# Altium project smart-water-quality-breakout.PrjPcb (part 2 of 5)

## Sheet battery-balancer.SchDoc
size Legal
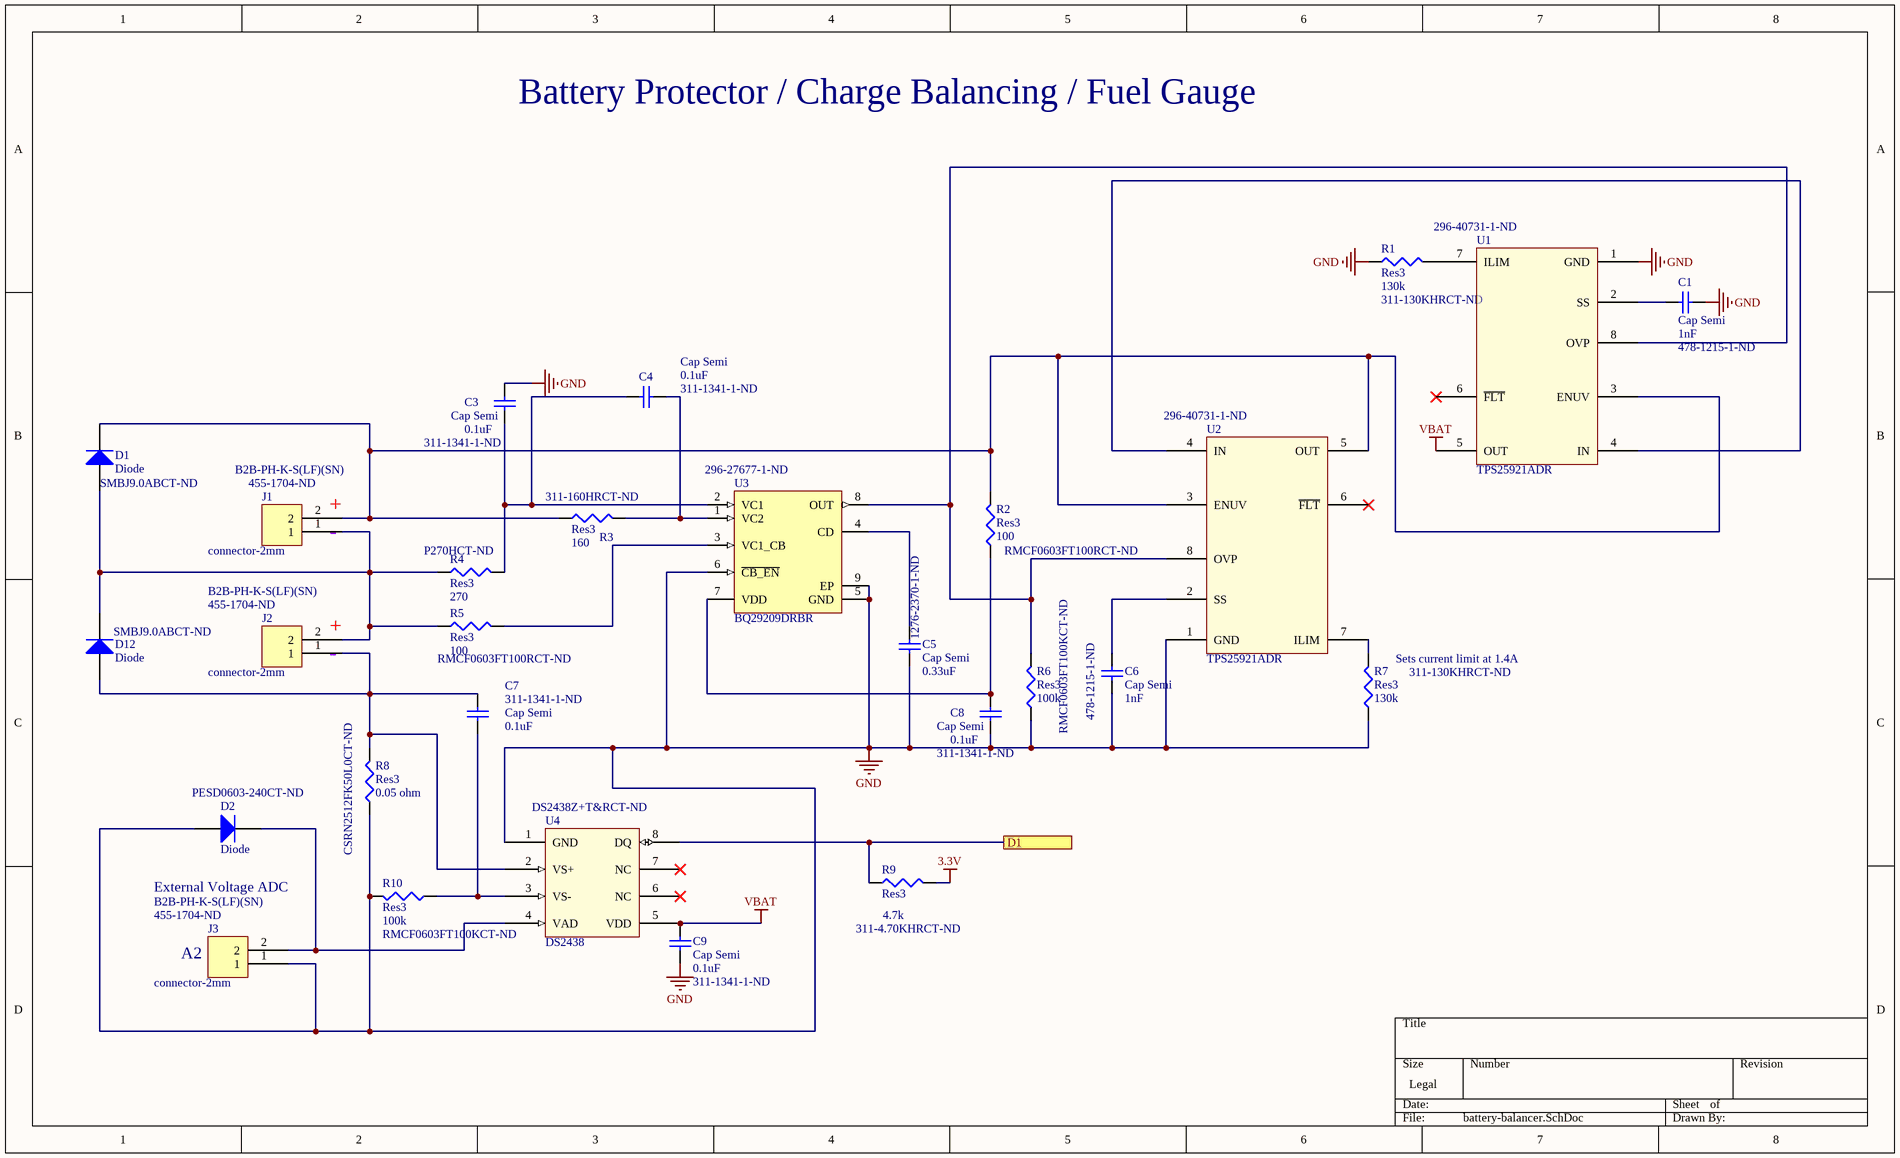
[diagram p1: battery-balancer.SchDoc]

### Parts
C1  Cap Semi  value 1nF  Supplier Part Number 1: 478-1215-1-ND  [1608[0603]]
C3  Cap Semi  value 0.1uF  Supplier Part Number 1: 311-1341-1-ND  [1608[0603]]
C4  Cap Semi  value 0.1uF  Supplier Part Number 1: 311-1341-1-ND  [1608[0603]]
C5  Cap Semi  value 0.33uF  Supplier Part Number 1: 1276-2370-1-ND  [1608[0603]]
C6  Cap Semi  value 1nF  Supplier Part Number 1: 478-1215-1-ND  [1608[0603]]
C7  Cap Semi  value 0.1uF  Supplier Part Number 1: 311-1341-1-ND  [1608[0603]]
C8  Cap Semi  value 0.1uF  Supplier Part Number 1: 311-1341-1-ND  [1608[0603]]
C9  Cap Semi  value 0.1uF  Supplier Part Number 1: 311-1341-1-ND  [1608[0603]]
D1  Diode  Supplier Part Number 1: SMBJ9.0ABCT-ND  [smbj]
D2  Diode  Supplier Part Number 1: PESD0603-240CT-ND  [J1-0603]
D12  Diode  Supplier Part Number 1: SMBJ9.0ABCT-ND  [smbj]
J1  connector-2mm  Supplier Part Number 1: 455-1704-ND  [B2B-PH-K-S(LF)(SN)]
J2  connector-2mm  Supplier Part Number 1: 455-1704-ND  [B2B-PH-K-S(LF)(SN)]
J3  connector-2mm  Supplier Part Number 1: 455-1704-ND  [B2B-PH-K-S(LF)(SN)]
R1  Res3  value 130k  Supplier Part Number 1: 311-130KHRCT-ND  [J1-0603]
R2  Res3  value 100  Supplier Part Number 1: RMCF0603FT100RCT-ND  [J1-0603]
R3  Res3  value 160  Supplier Part Number 1: 311-160HRCT-ND  [J1-0603]
R4  Res3  value 270  Supplier Part Number 1: P270HCT-ND  [J1-0603]
R5  Res3  value 100  Supplier Part Number 1: RMCF0603FT100RCT-ND  [J1-0603]
R6  Res3  value 100k  Supplier Part Number 1: RMCF0603FT100KCT-ND  [J1-0603]
R7  Res3  value 130k  Supplier Part Number 1: 311-130KHRCT-ND  [J1-0603]
R8  Res3  value 0.05 ohm  Supplier Part Number 1: CSRN2512FK50L0CT-ND  [2512-resistor]
R9  Res3  value 4.7k  Supplier Part Number 1: 311-4.70KHRCT-ND  [J1-0603]
R10  Res3  value 100k  Supplier Part Number 1: RMCF0603FT100KCT-ND  [J1-0603]
U1  TPS25921ADR  Supplier Part Number 1: 296-40731-1-ND  [D0008A_L]
U2  TPS25921ADR  Supplier Part Number 1: 296-40731-1-ND  [D0008A_L]
U3  BQ29209DRBR  Supplier Part Number 1: 296-27677-1-ND  [DRB0008B_V]
U4  DS2438  Supplier Part Number 1: DS2438Z+T&RCT-ND  [21-0041B_8]

### Ports
D1

### Nets
3.3V: R9.2
GND: C1.1 C3.2 C5.2 C6.1 C8.1 C9.2 D2.1(A) J3.1 R1.1 R6.1 R7.1 R8.1 R10.2 U1.1(GND) U2.1(GND) U3.5(GND) U3.6(~{CB_EN}) U3.9(EP) U4.1(GND)
VBAT: C9.1 U1.5(OUT) U4.5(VDD)
NetC1_2: C1.2 U1.2(SS)
NetC3_1: C3.1 C4.2 R4.2 U3.2(VC1)
NetC4_1: C4.1 R3.2 U3.1(VC2)
NetC5_1: C5.1 U3.4(CD)
NetC6_2: C6.2 U2.2(SS)
NetC7_1: C7.1 R10.1 U4.3(VS-)
NetC7_2: C7.2 D12.1(A) J2.1 R8.2 U4.2(VS+)
NetC8_2: C8.2 R2.1 U3.7(VDD)
NetD1_1: D1.1(A) D12.2(K) J1.1 J2.2 R4.1 R5.1
NetD1_2: D1.2(K) J1.2 R2.2 R3.1 U1.3(ENUV) U2.3(ENUV) U2.5(OUT)
NetD2_2: D2.2(K) J3.2 U4.4(VAD)
NetR1_2: R1.2 U1.7(ILIM)
NetR5_2: R5.2 U3.3(VC1_CB)
NetR6_2: R6.2 U1.8(OVP) U2.8(OVP) U3.8(OUT)
NetR7_2: R7.2 U2.7(ILIM)
NetR9_1: R9.1 U4.8(DQ) ; port D1
NetU1_4: U1.4(IN) U2.4(IN)

Not connected (* = marked no-connect by the designer): U1 6(~{FLT})*; U2 6(~{FLT})*; U4 6(NC)* 7(NC)*

### Notes on the sheet
- Battery Protector / Charge Balancing / Fuel Gauge
- (near J1) +
- (near J1) -
- (near J2) +
- (near J2) -
- (near R7) Sets current limit at 1.4A
- External Voltage ADC
- (near J3) A2

### Library data of the parts
C1 C6 = Cap Semi: Capacitor (Semiconductor SIM Model); Manufacturer: Kyocera AVX; Manufacturer Part Number: 06035C102KAT2A; Dielectric Material: Ceramic; Tolerance: 10%; Dielectric: X7R; Voltage Rating (DC): 50V; Published: 8-Jun-2000; LatestRevisionDate: 29-May-2009; LatestRevisionNote: IPC-7351 Footprint Added.; PackageReference: C1206; Publisher: Altium Limited; PackageDescription: Chip Capacitor; Supplier 1: Digi-Key; Stock 1: 5706824; Pricing 1: 1 = 0.10000, 10 = 0.05800, 100 = 0.02590, 500 = 0.01852, 1000 = 0.01455 (USD); RoHS: Yes; Mount: Surface Mount; Case/Package: 0603; Number of Pins: 2; Weight: 7.1E-05oz; Case Code (Imperial): 0603; Case Code (Metric): 1608; Contact Plating: Tin; Min Operating Temperature: -55°C; Max Operating Temperature: 125°C; Capacitance: 1nF; Packaging: Tape and Reel; Voltage: 50V; Voltage Rating: 50V; Package Quantity: 4000; Termination: SMD/SMT; Length: 1.6mm; Height: 0.9mm; Depth: 0.81mm; Width: 0.81mm; Thickness: 0.035inch; Radiation Hardening: No; REACH SVHC: No SVHC; Lead Free: Lead Free; ComponentLink1URL: https://datasheet.ciiva.com/11787/0900766b802d4698-11787050.pdf?src-supplier=RSComponents; ComponentLink1Description: https://datasheet.ciiva.com/11787/0900766b802d4698-11787050.pdf?src-supplier=RSComponents; ComponentLink2URL: https://datasheet.ciiva.com/1124/1679506-1124839.pdf?src-supplier=Element14; ComponentLink2Description: https://datasheet.ciiva.com/1124/1679506-1124839.pdf?src-supplier=Element14; ComponentLink3URL: https://datasheet.ciiva.com/14595/70001075-14595287.pdf?src-supplier=Allied+Electronics; ComponentLink3Description: https://datasheet.ciiva.com/14595/70001075-14595287.pdf?src-supplier=Allied+Electronics; ComponentLink4URL: https://datasheet.ciiva.com/1124/1679506-1124840.pdf?src-supplier=Element14; ComponentLink4Description: https://datasheet.ciiva.com/1124/1679506-1124840.pdf?src-supplier=Element14; ComponentLink5URL: https://datasheet.ciiva.com/7855/1679506-7855080.pdf?src-supplier=Element14; ComponentLink5Description: https://datasheet.ciiva.com/7855/1679506-7855080.pdf?src-supplier=Element14; ComponentLink6URL: https://datasheet.ciiva.com/2987/cx7r-2987819.pdf?src-supplier=Avnet; ComponentLink6Description: https://datasheet.ciiva.com/2987/cx7r-2987819.pdf?src-supplier=Avnet; ComponentLink7URL: https://datasheet.ciiva.com/150/cx7r-150236.pdf?src-supplier=Digi-Key; ComponentLink7Description: https://datasheet.ciiva.com/150/cx7r-150236.pdf?src-supplier=Digi-Key; ComponentLink8URL: https://datasheet.ciiva.com/2987/cx7r-2987820.pdf?src-supplier=Avnet; ComponentLink8Description: https://datasheet.ciiva.com/2987/cx7r-2987820.pdf?src-supplier=Avnet; ComponentLink9URL: https://datasheet.ciiva.com/150/cx7r-150237.pdf?src-supplier=Digi-Key; ComponentLink9Description: https://datasheet.ciiva.com/150/cx7r-150237.pdf?src-supplier=Digi-Key; ComponentLink10URL: https://datasheet.ciiva.com/16327/cx7r-16327069.pdf?src-supplier=Future+Electronics; ComponentLink10Description: https://datasheet.ciiva.com/16327/cx7r-16327069.pdf?src-supplier=Future+Electronics; ComponentLink11URL: https://datasheet.ciiva.com/16538/cx7r-16538173.pdf?src-supplier=Avnet+Asia; ComponentLink11Description: https://datasheet.ciiva.com/16538/cx7r-16538173.pdf?src-supplier=Avnet+Asia; ComponentLink12URL: https://datasheet.ciiva.com/150/cx7r-150238.pdf?src-supplier=Digi-Key; ComponentLink12Description: https://datasheet.ciiva.com/150/cx7r-150238.pdf?src-supplier=Digi-Key
C3 C4 C7-C9 = Cap Semi: Capacitor (Semiconductor SIM Model); Manufacturer: Yageo; Manufacturer Part Number: CC0603KRX7R8BB104; Capacitance: 100nF; Tolerance: 10%; Dielectric: X7R; Voltage Rating: 25V; Published: 8-Jun-2000; LatestRevisionDate: 29-May-2009; LatestRevisionNote: IPC-7351 Footprint Added.; PackageReference: C1206; Publisher: Altium Limited; PackageDescription: Chip Capacitor; Supplier 1: Digi-Key; Stock 1: 23299362; Pricing 1: 1 = 0.12000, 10 = 0.08400, 100 = 0.03950, 500 = 0.02770, 1000 = 0.02293 (USD); RoHS: Yes; Mount: Surface Mount; Case/Package: 0603; Number of Pins: 2; Case Code (Imperial): 0603; Case Code (Metric): 1608; Min Operating Temperature: -55°C; Max Operating Temperature: 125°C; Packaging: Tape and Reel; Package Quantity: 1; Voltage Rating (DC): 25V; Termination: SMD/SMT; Composition: Ceramic; Voltage: 25V; Length: 1.6mm; Height: 0.8mm; Width: 0.8mm; Thickness: 0.035inch; Depth: 0.8mm; Radiation Hardening: No; REACH SVHC: Unknown; Lead Free: Lead Free; Halogen Free: Halogen Free; ComponentLink1URL: https://datasheet.ciiva.com/11786/0900766b80c10176-11786120.pdf?src-supplier=RSComponents; ComponentLink1Description: https://datasheet.ciiva.com/11786/0900766b80c10176-11786120.pdf?src-supplier=RSComponents; ComponentLink2URL: https://datasheet.ciiva.com/144/mlccorderingcode-144075.pdf?src-supplier=Digi-Key; ComponentLink2Description: https://datasheet.ciiva.com/144/mlccorderingcode-144075.pdf?src-supplier=Digi-Key; ComponentLink3URL: https://datasheet.ciiva.com/17434/upy-gphc-x7r-6-3v-to-50v-8-17434263.pdf?src-supplier=Avnet+Europe; ComponentLink3Description: https://datasheet.ciiva.com/17434/upy-gphc-x7r-6-3v-to-50v-8-17434263.pdf?src-supplier=Avnet+Europe; ComponentLink4URL: https://datasheet.ciiva.com/13389/upy-gphc-x7r-6-3v-to-50v-8-13389352.pdf?src-supplier=Mouser; ComponentLink4Description: https://datasheet.ciiva.com/13389/upy-gphc-x7r-6-3v-to-50v-8-13389352.pdf?src-supplier=Mouser; ComponentLink5URL: https://datasheet.ciiva.com/144/mlccorderingcode-144073.pdf?src-supplier=Digi-Key; ComponentLink5Description: https://datasheet.ciiva.com/144/mlccorderingcode-144073.pdf?src-supplier=Digi-Key; ComponentLink6URL: https://datasheet.ciiva.com/144/mlccorderingcode-144074.pdf?src-supplier=Digi-Key; ComponentLink6Description: https://datasheet.ciiva.com/144/mlccorderingcode-144074.pdf?src-supplier=Digi-Key; ComponentLink7URL: https://datasheet.ciiva.com/26829/getdatasheetpartid-403577-26829431.pdf?src-supplier=Verical; ComponentLink7Description: https://datasheet.ciiva.com/26829/getdatasheetpartid-403577-26829431.pdf?src-supplier=Verical; ComponentLink8URL: https://datasheet.ciiva.com/11587/upy-gphc-x7r-6-3v-to-50v-8-11587208.pdf?src-supplier=Avnet; ComponentLink8Description: https://datasheet.ciiva.com/11587/upy-gphc-x7r-6-3v-to-50v-8-11587208.pdf?src-supplier=Avnet; ComponentLink9URL: https://datasheet.ciiva.com/28450/1489800-28450584.pdf?src-supplier=Element14; ComponentLink9Description: https://datasheet.ciiva.com/28450/1489800-28450584.pdf?src-supplier=Element14; ComponentLink10URL: https://datasheet.ciiva.com/7978/1489800-7978155.pdf?src-supplier=Element14; ComponentLink10Description: https://datasheet.ciiva.com/7978/1489800-7978155.pdf?src-supplier=Element14
C5 = Cap Semi: Capacitor (Semiconductor SIM Model); Manufacturer: Samsung; Manufacturer Part Number: CL10F334ZA8NNNC; Tolerance: 80%; Capacitance: 330nF; Dielectric: Y5V; Voltage Rating: 25V; Published: 8-Jun-2000; LatestRevisionDate: 29-May-2009; LatestRevisionNote: IPC-7351 Footprint Added.; PackageReference: C1206; Publisher: Altium Limited; PackageDescription: Chip Capacitor; Supplier 1: Digi-Key; Stock 1: 209630; Pricing 1: 1 = 0.10000, 10 = 0.06700, 100 = 0.02970, 500 = 0.02122, 1000 = 0.01667 (USD); RoHS: Yes; Mount: Surface Mount; Case/Package: 0603; Case Code (Metric): 1608; Case Code (Imperial): 0603; Contact Plating: Tin; Min Operating Temperature: -30°C; Max Operating Temperature: 85°C; Packaging: Tape and Reel; Package Quantity: 1; Voltage Rating (DC): 25V; Voltage: 25V; Length: 1.6mm; Height: 0.8mm; Width: 0.031inch; Thickness: 0.035inch; Depth: 0.8mm; Radiation Hardening: No; Lead Free: Lead Free; ComponentLink1URL: https://datasheet.ciiva.com/26878/getdatasheetpartid-642180-26878039.pdf?src-supplier=Verical; ComponentLink1Description: https://datasheet.ciiva.com/26878/getdatasheetpartid-642180-26878039.pdf?src-supplier=Verical; ComponentLink2URL: https://datasheet.ciiva.com/16376/cl05b104kq5nnnc-16376699.pdf?src-supplier=Future+Electronics; ComponentLink2Description: https://datasheet.ciiva.com/16376/cl05b104kq5nnnc-16376699.pdf?src-supplier=Future+Electronics
D1 D12 = Diode: Default Diode; Manufacturer: Bourns; Manufacturer Part Number: SMBJ9.0A; Direction: Unidirectional; Reverse Breakdown Voltage: 100V; Operating Supply Voltage: 3.5V; Max Surge Current: 100A; Number of Unidirectional Channels: 1; Reverse Standoff Voltage: 90V; Clamping Voltage: 146V; Peak Pulse Power: 600W; Power Line Protection: No; Max Reverse Leakage Current: 10uA; Test Current: 1mA; Peak Pulse Current: 4.1A; Element Configuration: Single; Leakage Current: 5uA; ComponentLink1URL: http://www.bourns.com/data/global/pdfs/SMBJ.pdf; ComponentLink1Description: http://www.bourns.com/data/global/pdfs/SMBJ.pdf; ComponentLink2URL: https://datasheet.ciiva.com/25624/0900766b810f4eeb-25624683.pdf?src-supplier=RSComponents; ComponentLink2Description: https://datasheet.ciiva.com/25624/0900766b810f4eeb-25624683.pdf?src-supplier=RSComponents; ComponentLink3URL: https://datasheet.ciiva.com/15143/getdatasheetpartid-158332-15143823.pdf?src-supplier=Verical; ComponentLink3Description: https://datasheet.ciiva.com/15143/getdatasheetpartid-158332-15143823.pdf?src-supplier=Verical; ComponentLink4URL: https://datasheet.ciiva.com/331/littelfuse-tvs-diode-smbj-datasheet-pdf-331232.pdf?src-supplier=Digi-Key; ComponentLink4Description: https://datasheet.ciiva.com/331/littelfuse-tvs-diode-smbj-datasheet-pdf-331232.pdf?src-supplier=Digi-Key; ComponentLink5URL: https://datasheet.ciiva.com/8062/littelfuse-tvs-diode-smbj-8062311.pdf?src-supplier=Element14; ComponentLink5Description: https://datasheet.ciiva.com/8062/littelfuse-tvs-diode-smbj-8062311.pdf?src-supplier=Element14; ComponentLink6URL: https://datasheet.ciiva.com/331/littelfuse-tvs-diode-smbj-datasheet-pdf-331230.pdf?src-supplier=Digi-Key; ComponentLink6Description: https://datasheet.ciiva.com/331/littelfuse-tvs-diode-smbj-datasheet-pdf-331230.pdf?src-supplier=Digi-Key; ComponentLink7URL: https://datasheet.ciiva.com/331/littelfuse-tvs-diode-smbj-datasheet-pdf-331231.pdf?src-supplier=Digi-Key; ComponentLink7Description: https://datasheet.ciiva.com/331/littelfuse-tvs-diode-smbj-datasheet-pdf-331231.pdf?src-supplier=Digi-Key; ComponentLink8URL: https://datasheet.ciiva.com/16354/littelfuse-tvs-diode-smbj-16354943.pdf?src-supplier=Future+Electronics; ComponentLink8Description: https://datasheet.ciiva.com/16354/littelfuse-tvs-diode-smbj-16354943.pdf?src-supplier=Future+Electronics; Supplier 1: Digi-Key; Stock 1: 26139; Pricing 1: 1 = 0.48000, 10 = 0.33800, 25 = 0.27800, 100 = 0.22230, 250 = 0.16168, 500 = 0.13136, 1000 = 0.10104 (USD); RoHS: Yes; Mount: Surface Mount; Case/Package: SMB; Number of Pins: 2; Min Operating Temperature: -55°C; Max Operating Temperature: 150°C; Packaging: Tape and Reel; Package Quantity: 3000; Min Breakdown Voltage: 100V; Breakdown Voltage: 100V; Number of Channels: 1; Polarity: Unidirectional; Termination: SMD/SMT; Number of Elements: 1; Max Power Dissipation: 600W; Composition: Zener; Radiation Hardening: No; ComponentLink9URL: https://datasheet.ciiva.com/26787/smbj90a-26787787.pdf?src-supplier=IIIC; ComponentLink9Description: https://datasheet.ciiva.com/26787/smbj90a-26787787.pdf?src-supplier=IIIC; ComponentLink10URL: https://datasheet.ciiva.com/17413/smbj-17413495.pdf?src-supplier=Avnet+Europe; ComponentLink10Description: https://datasheet.ciiva.com/17413/smbj-17413495.pdf?src-supplier=Avnet+Europe; ComponentLink11URL: https://datasheet.ciiva.com/334/smbj-334092.pdf?src-supplier=Digi-Key; ComponentLink11Description: https://datasheet.ciiva.com/334/smbj-334092.pdf?src-supplier=Digi-Key; ComponentLink12URL: https://datasheet.ciiva.com/334/smbj-334188.pdf?src-supplier=Digi-Key; ComponentLink12Description: https://datasheet.ciiva.com/334/smbj-334188.pdf?src-supplier=Digi-Key; ComponentLink13URL: https://datasheet.ciiva.com/334/smbj-334093.pdf?src-supplier=Digi-Key; ComponentLink13Description: https://datasheet.ciiva.com/334/smbj-334093.pdf?src-supplier=Digi-Key; ComponentLink14URL: https://datasheet.ciiva.com/334/smbj-334189.pdf?src-supplier=Digi-Key; ComponentLink14Description: https://datasheet.ciiva.com/334/smbj-334189.pdf?src-supplier=Digi-Key; ComponentLink15URL: https://datasheet.ciiva.com/334/smbj-334094.pdf?src-supplier=Digi-Key; ComponentLink15Description: https://datasheet.ciiva.com/334/smbj-334094.pdf?src-supplier=Digi-Key; ComponentLink16URL: https://datasheet.ciiva.com/334/smbj-334190.pdf?src-supplier=Digi-Key; ComponentLink16Description: https://datasheet.ciiva.com/334/smbj-334190.pdf?src-supplier=Digi-Key
D2 = Diode: Default Diode; Manufacturer: Littelfuse; Manufacturer Part Number: RF1256-000; Clamping Voltage: 45V; Reverse Standoff Voltage: 24V; Power Line Protection: No; Number of Bidirectional Channels: 1; Published: 8-Jun-2000; LatestRevisionDate: 17-Jul-2002; LatestRevisionNote: Re-released for DXP Platform.; PackageVersion: Sep-1996; PackageReference: SMC; Publisher: Altium Limited; PackageDescription: DO-214-AB/SMC; 2 C-Bend Leads; Body 7.9 x 5.9 mm, inc. leads (LxW); Code_JEDEC: DO-214-AB; Supplier 1: Digi-Key; Stock 1: 74186; Pricing 1: 1 = 0.58000, 10 = 0.45300, 25 = 0.38200, 100 = 0.31080, 250 = 0.25752, 500 = 0.21312, 1000 = 0.15984, 2500 = 0.14652 (USD); RoHS: Yes; Mount: Surface Mount; Case/Package: 0603; Case Code (Metric): 1608; Case Code (Imperial): 0603; Min Operating Temperature: -55°C; Max Operating Temperature: 125°C; Packaging: Tape and Reel; Composition: Zener; ComponentLink1URL: http://www.littelfuse.com/~/media/electronics/datasheets/polymer_esd_suppressors/littelfuse_polymer_esd_suppressor_pesd_catalog_datasheet.pdf.pdf?src-supplier=Digi-Key; ComponentLink1Description: http://www.littelfuse.com/~/media/electronics/datasheets/polymer_esd_suppressors/littelfuse_polymer_esd_suppressor_pesd_catalog_datasheet.pdf.pdf?src-supplier=Digi-Key
J1-J3 = connector-2mm: Manufacturer: JST; Connector Type: Male Pin; Current Rating: 2A; Contact Resistance: 20mR; Number of Poles: 2; Voltage Rating: 100V; Insulation Resistance: 1MR; Gender: Male; Pitch: 2mm; Supplier 1: Digi-Key; Manufacturer Part Number: B2B-PH-K-S(LF)(SN); Stock 1: 287924; Pricing 1: 1 = 0.17000, 10 = 0.16200, 100 = 0.10020, 500 = 0.08288, 1000 = 0.07252, 5000 = 0.06216, 10000 = 0.06044 (USD); RoHS: Yes; Mount: Through Hole; Number of Pins: 2; Contact Material: Brass; Contact Plating: Tin; Color: Natural; Housing Color: White; Housing Material: Polyamide; Min Operating Temperature: -25°C; Max Operating Temperature: 85°C; Termination: Solder; Max Current Rating: 2A; Number of Rows: 1; Voltage Rating (AC): 100V; Packaging: Bulk; Number of Positions: 2; Fastening Type: Detent; Max Voltage Rating (AC): 100V; Number of Contacts: 2; Working Voltage: 100V; Max Voltage Rating (DC): 100V; Orientation: Straight; Length: 5.9mm; Height: 9.4mm; Width: 4.5mm; Lead Pitch: 2mm; Contact Mating Length: 0.13inch; Depth: 4.5mm; REACH SVHC: No SVHC; Lead Free: Lead Free; ComponentLink1URL: https://datasheet.ciiva.com/6747/80560-6747392.pdf?src-supplier=Newark; ComponentLink1Description: https://datasheet.ciiva.com/6747/80560-6747392.pdf?src-supplier=Newark; ComponentLink2URL: https://datasheet.ciiva.com/11746/0900766b8082f551-11746676.pdf?src-supplier=RSComponents; ComponentLink2Description: https://datasheet.ciiva.com/11746/0900766b8082f551-11746676.pdf?src-supplier=RSComponents; ComponentLink3URL: https://datasheet.ciiva.com/8052/80560-8052022.pdf?src-supplier=Element14; ComponentLink3Description: https://datasheet.ciiva.com/8052/80560-8052022.pdf?src-supplier=Element14; ComponentLink4URL: https://datasheet.ciiva.com/712/eph-712442.pdf?src-supplier=Digi-Key; ComponentLink4Description: https://datasheet.ciiva.com/712/eph-712442.pdf?src-supplier=Digi-Key; ComponentLink5URL: https://datasheet.ciiva.com/16422/b2b-ph-k-slfsn-16422715.pdf?src-supplier=Future+Electronics; ComponentLink5Description: https://datasheet.ciiva.com/16422/b2b-ph-k-slfsn-16422715.pdf?src-supplier=Future+Electronics
R1 R7 = Res3: Resistor; Manufacturer: Yageo; Manufacturer Part Number: RC0603FR-07130KL; Resistance: 130kR; Tolerance: 1%; Temperature Coefficient: 100ppm/°C; Voltage Rating (DC): 50V; Power Rating: 100mW; Voltage Rating: 75V; Published: 8-Jun-2000; LatestRevisionDate: 29-May-2009; LatestRevisionNote: IPC-7351 Footprint Added.; PackageReference: J1-0603; Publisher: Altium Limited; PackageDescription: Chip Resistor; Supplier 1: Digi-Key; Stock 1: 773087; Pricing 1: 1 = 0.10000, 10 = 0.02400, 100 = 0.00970, 1000 = 0.00437, 2500 = 0.00379 (USD); RoHS: Yes; Case/Package: 0603; Weight: 7.1E-05oz; Case Code (Imperial): 0603; Case Code (Metric): 1608; Min Operating Temperature: -55°C; Max Operating Temperature: 155°C; Packaging: Tape and Reel; Composition: Thick Film; Package Quantity: 1; Termination: SMD/SMT; Number of Terminations: 2; Military Standard: Not; Max Power Dissipation: 100mW; Features: Moisture Resistant; Length: 1.6mm; Height: 0.022inch; Width: 0.8mm; Depth: 0.8mm; Lead Free: Lead Free; ComponentLink1URL: https://datasheet.ciiva.com/2455/pyu-r-int-thick-7-2455192.pdf?src-supplier=Digi-Key; ComponentLink1Description: https://datasheet.ciiva.com/2455/pyu-r-int-thick-7-2455192.pdf?src-supplier=Digi-Key; ComponentLink2URL: https://datasheet.ciiva.com/2455/pyu-r-int-thick-7-2455191.pdf?src-supplier=Digi-Key; ComponentLink2Description: https://datasheet.ciiva.com/2455/pyu-r-int-thick-7-2455191.pdf?src-supplier=Digi-Key; ComponentLink3URL: https://datasheet.ciiva.com/2455/pyu-r-int-thick-7-2455193.pdf?src-supplier=Digi-Key; ComponentLink3Description: https://datasheet.ciiva.com/2455/pyu-r-int-thick-7-2455193.pdf?src-supplier=Digi-Key
R2 R5 = Res3: Resistor; Manufacturer: Stackpole Electronics; Manufacturer Part Number: RMCF0603FT100R; Resistance: 100R; Power Rating: 100mW; Tolerance: 1%; Temperature Coefficient: 100ppm/°C; Published: 8-Jun-2000; LatestRevisionDate: 29-May-2009; LatestRevisionNote: IPC-7351 Footprint Added.; PackageReference: J1-0603; Publisher: Altium Limited; PackageDescription: Chip Resistor; Supplier 1: Digi-Key; Stock 1: 2775736; Pricing 1: 1 = 0.10000, 10 = 0.01700, 100 = 0.00680, 1000 = 0.00306, 2500 = 0.00266 (USD); RoHS: Yes; Mount: Surface Mount; Case/Package: 0603; Case Code (Metric): 1608; Case Code (Imperial): 0603; Contact Plating: Tin; Min Operating Temperature: -55°C; Max Operating Temperature: 155°C; Packaging: Tape and Reel; Composition: Thick Film; Number of Terminations: 2; Military Standard: Not; Max Power Dissipation: 100mW; Features: Automotive AEC-Q200; Length: 1.55mm; Height: 0.022inch; Width: 0.031inch; Depth: 0.8mm; Radiation Hardening: No; Lead Free: Lead Free; ComponentLink1URL: https://datasheet.ciiva.com/15215/getdatasheetpartid-360413-15215981.pdf?src-supplier=Verical; ComponentLink1Description: https://datasheet.ciiva.com/15215/getdatasheetpartid-360413-15215981.pdf?src-supplier=Verical
R3 = Res3: Resistor; Manufacturer: Yageo; Manufacturer Part Number: RC0603FR-07160RL; Tolerance: 1%; Power Rating: 100mW; Resistance: 160R; Voltage Rating: 75V; Temperature Coefficient: 100ppm/°C; Voltage Rating (DC): 50V; Published: 8-Jun-2000; LatestRevisionDate: 29-May-2009; LatestRevisionNote: IPC-7351 Footprint Added.; PackageReference: J1-0603; Publisher: Altium Limited; PackageDescription: Chip Resistor; Supplier 1: Digi-Key; Stock 1: 508932; Pricing 1: 1 = 0.10000, 10 = 0.02400, 100 = 0.00970, 1000 = 0.00437, 2500 = 0.00379 (USD); RoHS: Yes; Mount: Surface Mount; Case/Package: 0603; Weight: 7.1E-05oz; Case Code (Metric): 1608; Case Code (Imperial): 0603; Min Operating Temperature: -55°C; Max Operating Temperature: 155°C; Packaging: Tape and Reel; Package Quantity: 1; Composition: Thick Film; Number of Terminations: 2; Termination: SMD/SMT; Military Standard: Not; Max Power Dissipation: 100mW; Features: Moisture Resistant; Length: 1.6mm; Height: 0.45mm; Width: 0.031inch; Depth: 0.8mm; Lead Free: Lead Free; ComponentLink1URL: https://datasheet.ciiva.com/11808/0900766b80f96399-11808753.pdf?src-supplier=RSComponents; ComponentLink1Description: https://datasheet.ciiva.com/11808/0900766b80f96399-11808753.pdf?src-supplier=RSComponents; ComponentLink2URL: https://datasheet.ciiva.com/2454/pyu-r-int-thick-7-2454168.pdf?src-supplier=Digi-Key; ComponentLink2Description: https://datasheet.ciiva.com/2454/pyu-r-int-thick-7-2454168.pdf?src-supplier=Digi-Key; ComponentLink3URL: https://datasheet.ciiva.com/2454/pyu-r-int-thick-7-2454169.pdf?src-supplier=Digi-Key; ComponentLink3Description: https://datasheet.ciiva.com/2454/pyu-r-int-thick-7-2454169.pdf?src-supplier=Digi-Key; ComponentLink4URL: https://datasheet.ciiva.com/2454/pyu-r-int-thick-7-2454170.pdf?src-supplier=Digi-Key; ComponentLink4Description: https://datasheet.ciiva.com/2454/pyu-r-int-thick-7-2454170.pdf?src-supplier=Digi-Key
R4 = Res3: Resistor; Manufacturer: Panasonic; Manufacturer Part Number: ERJ3EKF2700V; Resistance: 270R; Tolerance: 1%; Temperature Coefficient: 100ppm/°C; Power Rating: 100mW; Voltage Rating: 75V; Published: 8-Jun-2000; LatestRevisionDate: 29-May-2009; LatestRevisionNote: IPC-7351 Footprint Added.; PackageReference: J1-0603; Publisher: Altium Limited; PackageDescription: Chip Resistor; Supplier 1: Digi-Key; Stock 1: 596359; Pricing 1: 1 = 0.10000, 10 = 0.06500, 100 = 0.02640, 1000 = 0.01186, 2500 = 0.01029 (USD); RoHS: Yes; Mount: Surface Mount; Case/Package: 0603; Number of Pins: 2; Contact Plating: Tin; Case Code (Imperial): 0603; Case Code (Metric): 1608; Min Operating Temperature: -55°C; Max Operating Temperature: 155°C; Composition: Thick Film; Packaging: Tape and Reel; Package Quantity: 1; Number of Terminations: 2; Military Standard: Not; Termination: SMD/SMT; Max Power Dissipation: 100mW; Voltage Rating (DC): 75V; Features: Automotive AEC-Q200; Length: 1.6mm; Height: 0.022inch; Width: 0.8mm; Depth: 0.8mm; Radiation Hardening: No; REACH SVHC: No SVHC; Lead Free: Lead Free; ComponentLink1URL: https://datasheet.ciiva.com/5860/aoa0000ce2-5860661.pdf?src-supplier=Farnell; ComponentLink1Description: https://datasheet.ciiva.com/5860/aoa0000ce2-5860661.pdf?src-supplier=Farnell; ComponentLink2URL: https://datasheet.ciiva.com/9183/aoa0000ce2-9183606.pdf?src-supplier=Avnet; ComponentLink2Description: https://datasheet.ciiva.com/9183/aoa0000ce2-9183606.pdf?src-supplier=Avnet; ComponentLink3URL: https://datasheet.ciiva.com/16776/70260748-16776089.pdf?src-supplier=Allied+Electronics; ComponentLink3Description: https://datasheet.ciiva.com/16776/70260748-16776089.pdf?src-supplier=Allied+Electronics; ComponentLink4URL: https://datasheet.ciiva.com/17206/aoa0000ce2-17206490.pdf?src-supplier=Avnet+Europe; ComponentLink4Description: https://datasheet.ciiva.com/17206/aoa0000ce2-17206490.pdf?src-supplier=Avnet+Europe; ComponentLink5URL: https://datasheet.ciiva.com/7944/aoa0000ce2-7944619.pdf?src-supplier=Element14; ComponentLink5Description: https://datasheet.ciiva.com/7944/aoa0000ce2-7944619.pdf?src-supplier=Element14; ComponentLink6URL: https://datasheet.ciiva.com/16440/aoa0000ce2-16440189.pdf?src-supplier=Future+Electronics; ComponentLink6Description: https://datasheet.ciiva.com/16440/aoa0000ce2-16440189.pdf?src-supplier=Future+Electronics; ComponentLink7URL: https://datasheet.ciiva.com/46373/1678782-46373901.pdf?src-supplier=Element14; ComponentLink7Description: https://datasheet.ciiva.com/46373/1678782-46373901.pdf?src-supplier=Element14; ComponentLink8URL: https://datasheet.ciiva.com/16511/aoa0000ce2-16511694.pdf?src-supplier=Avnet+Asia; ComponentLink8Description: https://datasheet.ciiva.com/16511/aoa0000ce2-16511694.pdf?src-supplier=Avnet+Asia; ComponentLink9URL: https://datasheet.ciiva.com/16759/70260748-16759566.pdf?src-supplier=Allied+Electronics; ComponentLink9Description: https://datasheet.ciiva.com/16759/70260748-16759566.pdf?src-supplier=Allied+Electronics; ComponentLink10URL: https://datasheet.ciiva.com/22705/1678782-22705422.pdf?src-supplier=Element14; ComponentLink10Description: https://datasheet.ciiva.com/22705/1678782-22705422.pdf?src-supplier=Element14; ComponentLink11URL: https://datasheet.ciiva.com/46373/1678782-46373902.pdf?src-supplier=Element14; ComponentLink11Description: https://datasheet.ciiva.com/46373/1678782-46373902.pdf?src-supplier=Element14; ComponentLink12URL: https://datasheet.ciiva.com/30181/aoa0000ce2-30181327.pdf?src-supplier=Onlinecomponents.com; ComponentLink12Description: https://datasheet.ciiva.com/30181/aoa0000ce2-30181327.pdf?src-supplier=Onlinecomponents.com
R6 R10 = Res3: Resistor; Manufacturer: Stackpole Electronics; Manufacturer Part Number: RMCF0603FT100K; Resistance: 100kR; Power Rating: 100mW; Tolerance: 1%; Temperature Coefficient: 100ppm/°C; Working Voltage: 75V; Published: 8-Jun-2000; LatestRevisionDate: 29-May-2009; LatestRevisionNote: IPC-7351 Footprint Added.; PackageReference: J1-0603; Publisher: Altium Limited; PackageDescription: Chip Resistor; Supplier 1: Digi-Key; Stock 1: 1724179; Pricing 1: 1 = 0.10000, 10 = 0.01700, 100 = 0.00680, 1000 = 0.00306, 2500 = 0.00266 (USD); RoHS: Yes; Mount: Surface Mount; Case/Package: 0603; Case Code (Metric): 1608; Case Code (Imperial): 0603; Contact Plating: Tin; Min Operating Temperature: -55°C; Max Operating Temperature: 155°C; Packaging: Tape and Reel; Composition: Thick Film; Number of Terminations: 2; Military Standard: Not; Max Power Dissipation: 100mW; Features: Automotive AEC-Q200; Length: 1.55mm; Height: 0.022inch; Width: 0.031inch; Depth: 0.8mm; Radiation Hardening: No; Lead Free: Lead Free; ComponentLink1URL: https://datasheet.ciiva.com/15193/getdatasheetpartid-362597-15193437.pdf?src-supplier=Verical; ComponentLink1Description: https://datasheet.ciiva.com/15193/getdatasheetpartid-362597-15193437.pdf?src-supplier=Verical
R8 = Res3: Res Thick Film 2512 0.05 Ohm 1% 2W ±200ppm/C Molded SMD Automotive T/R; Manufacturer: Stackpole Electronics; Manufacturer Part Number: CSRN2512FK50L0; Resistance: 50mR; Temperature Coefficient: 200ppm/°C; ComponentLink1URL: https://www.seielect.com/catalog/SEI-Packaging.pdf?src-supplier=Digi-Key; ComponentLink1Description: https://www.seielect.com/catalog/SEI-Packaging.pdf?src-supplier=Digi-Key; ComponentLink2URL: https://www.seielect.com/Catalog/SEI-CSR_CSRN.pdf?src-supplier=Avnet; ComponentLink2Description: https://www.seielect.com/Catalog/SEI-CSR_CSRN.pdf?src-supplier=Avnet; ComponentLink3URL: http://www.seielect.com/Catalog/SEI-CSR.pdf?src-supplier=Future+Electronics; ComponentLink3Description: http://www.seielect.com/Catalog/SEI-CSR.pdf?src-supplier=Future+Electronics; ComponentLink4URL: http://components.arrow.com/part/dataview/53687976S385769N1174?src-supplier=Arrow; ComponentLink4Description: http://components.arrow.com/part/dataview/53687976S385769N1174?src-supplier=Arrow; ComponentLink5URL: https://www.seielect.com/Catalog/SEI-CSR_CSRN.pdf?src-supplier=Avnet+Asia; ComponentLink5Description: https://www.seielect.com/Catalog/SEI-CSR_CSRN.pdf?src-supplier=Avnet+Asia; ComponentLink6URL: https://www.verical.com/server-webapp/html/getDatasheet?partID=750441&src-supplier=Verical; ComponentLink6Description: https://www.verical.com/server-webapp/html/getDatasheet?partID=750441&src-supplier=Verical; Supplier 1: Digi-Key; RoHS: Yes; Category: Chip SMD Resistors; Stock 1: 42163; Pricing 1: 1=0.63000, 10=0.46800, 25=0.37960, 50=0.33000, 100=0.27230, 250=0.23652, 500=0.19250 (USD); Mount: Surface Mount; Case/Package: 2512; Contact Plating: Tin,Matte; Case Code (Metric): 6432; Case Code (Imperial): 2512; Min Operating Temperature: -55°C; Max Operating Temperature: 155°C; Power Rating: 2W; Tolerance: 1%; Packaging: Tape and Reel; Max Power Dissipation: 2W; Composition: Thick Film; Number of Terminations: 2; Military Standard: Not; Length: 0.25inch; Height: 0.028inch; Width: 0.124inch; Depth: 3.15mm; Radiation Hardening: No; Lead Free: Lead Free; ComponentLink7URL: http://components.arrow.com/part/dataview/53687893S278672N1174?src-supplier=Arrow; ComponentLink7Description: http://components.arrow.com/part/dataview/53687893S278672N1174?src-supplier=Arrow; ComponentLink8URL: http://www.seielect.com/Catalog/SEI-CSR_CSRN.pdf?src-supplier=Future+Electronics; ComponentLink8Description: http://www.seielect.com/Catalog/SEI-CSR_CSRN.pdf?src-supplier=Future+Electronics; ComponentLink9URL: https://www.seielect.com/Catalog/SEI-CSR_CSRN.pdf?src-supplier=Digi-Key; ComponentLink9Description: https://www.seielect.com/Catalog/SEI-CSR_CSRN.pdf?src-supplier=Digi-Key; ComponentLink10URL: https://www.verical.com/server-webapp/html/getDatasheet?partID=698872&src-supplier=Verical; ComponentLink10Description: https://www.verical.com/server-webapp/html/getDatasheet?partID=698872&src-supplier=Verical
R9 = Res3: Resistor; Manufacturer: Yageo; Manufacturer Part Number: RC0603FR-074K7L; Tolerance: 1%; Resistance: 4.7kR; Temperature Coefficient: 100ppm/°C; Power Rating: 100mW; Voltage Rating (DC): 50V; Published: 8-Jun-2000; LatestRevisionDate: 29-May-2009; LatestRevisionNote: IPC-7351 Footprint Added.; PackageReference: J1-0603; Publisher: Altium Limited; PackageDescription: Chip Resistor; Supplier 1: Digi-Key; Stock 1: 18304102; Pricing 1: 1 = 0.10000, 10 = 0.02400, 100 = 0.00970, 1000 = 0.00437, 2500 = 0.00379 (USD); RoHS: Yes; Case/Package: 0603; Number of Pins: 2; Case Code (Imperial): 0603; Case Code (Metric): 1608; Min Operating Temperature: -55°C; Max Operating Temperature: 155°C; Composition: Thick Film; Packaging: Tape and Reel; Voltage Rating: 50V; Termination: SMD/SMT; Military Standard: Not; Length: 1.6mm; Height: 0.45mm; Width: 0.8mm; Depth: 0.8mm; Lead Pitch: 0.3mm; REACH SVHC: No SVHC; Lead Free: Lead Free; ComponentLink1URL: https://datasheet.ciiva.com/15189/getdatasheetpartid-422754-15189760.pdf?src-supplier=Verical; ComponentLink1Description: https://datasheet.ciiva.com/15189/getdatasheetpartid-422754-15189760.pdf?src-supplier=Verical; ComponentLink2URL: https://datasheet.ciiva.com/22747/443971-22747528.pdf?src-supplier=Element14; ComponentLink2Description: https://datasheet.ciiva.com/22747/443971-22747528.pdf?src-supplier=Element14; ComponentLink3URL: https://datasheet.ciiva.com/7660/38590-7660794.pdf?src-supplier=Element14; ComponentLink3Description: https://datasheet.ciiva.com/7660/38590-7660794.pdf?src-supplier=Element14; ComponentLink4URL: https://datasheet.ciiva.com/7746/1868787-7746365.pdf?src-supplier=Element14; ComponentLink4Description: https://datasheet.ciiva.com/7746/1868787-7746365.pdf?src-supplier=Element14; ComponentLink5URL: https://datasheet.ciiva.com/46440/1868787-46440909.pdf?src-supplier=Element14; ComponentLink5Description: https://datasheet.ciiva.com/46440/1868787-46440909.pdf?src-supplier=Element14; ComponentLink6URL: https://datasheet.ciiva.com/7746/1738695-7746366.pdf?src-supplier=Element14; ComponentLink6Description: https://datasheet.ciiva.com/7746/1738695-7746366.pdf?src-supplier=Element14
U1 U2 = TPS25921ADR: IC PWR MGR EFUSE 18V 8SOIC; Manufacturer: Texas Instruments; Number of Channels: 1; Min Supply Voltage: 4.5V; Max Output Current: 1.7A; Operating Supply Current: 410uA; Max Supply Current: 580uA; Supplier 1: Digi-Key; Manufacturer Part Number: TPS25921ADR; Stock 1: 75213; Pricing 1: 1=1.50000, 10=1.33700, 100=1.04240, 500=0.86108, 1000=0.67980 (USD); RoHS: Yes; Mount: Surface Mount; Case/Package: SOIC; Number of Pins: 8; Contact Plating: Gold; Min Operating Temperature: -40°C; Max Operating Temperature: 85°C; Packaging: Tape and Reel; Max Supply Voltage: 18V; Features: Auto Retry; Radiation Hardening: No; Lead Free: Lead Free; ComponentLink1URL: http://www.ti.com/general/docs/lit/getliterature.tsp?genericPartNumber=TPS25921L&&fileType=pdf&src-supplier=Avnet+Asia; ComponentLink1Description: http://www.ti.com/general/docs/lit/getliterature.tsp?genericPartNumber=TPS25921L&&fileType=pdf&src-supplier=Avnet+Asia; ComponentLink2URL: http://www.ti.com/lit/ds/symlink/tps25921a.pdf?src-supplier=Digi-Key; ComponentLink2Description: http://www.ti.com/lit/ds/symlink/tps25921a.pdf?src-supplier=Digi-Key; ComponentLink3URL: http://www.ti.com/general/docs/lit/getliterature.tsp?genericPartNumber=TPS25921L&&fileType=pdf&src-supplier=Avnet; ComponentLink3Description: http://www.ti.com/general/docs/lit/getliterature.tsp?genericPartNumber=TPS25921L&&fileType=pdf&src-supplier=Avnet
U3 = CMP-0321-00626-2: Voltage Protection with Automatic Cell Balance for 2-Cell Li-Ion Batteries, OVP=4.3 V, -40 to 85 degC, 8-pin SON (DRB), Green (RoHS & no Sb/Br); Manufacturer: Texas Instruments; SubFamily: Lithium Ion Protection; Lead Acid: N; Output Voltage: 4.3V; Min Supply Voltage: 4V; Max Supply Voltage: 10V; Output Current: 85uA; Operating Supply Current: 6uA; Number of Batteries: 2; PackageReference: DRB0008B; Li-Ion: N; PackageVersion: revK, Jun-2012; PartNumber: BQ29209DRBR; Eco-Plan: Green (RoHS & no Sb/Br); DatasheetVersion: SLUSA52A; PackageDescription: 8-Pin Plastic Small Outline No-Lead, 3 x 3 x 1 mm Body, 0.65 mm Pitch, Exposed Pad; Li-Polymer: N; Mounting Technology: Surface Mount; Over Voltage Protection: N; NiCd: N; ComponentLink1URL: http://www.ti.com/general/docs/lit/getliterature.tsp?genericPartNumber=BQ29209&fileType=pdf; ComponentLink1Description: Datasheet; NiMH: N; Supplier 1: Digi-Key; Manufacturer Part Number: BQ29209DRBR; Stock 1: 15242; Pricing 1: 1 = 0.90000, 10 = 0.80200, 100 = 0.62540, 500 = 0.51664, 1000 = 0.40788 (USD); RoHS: Yes; Number of Pins: 8; Contact Plating: Gold; Min Operating Temperature: -40°C; Max Operating Temperature: 110°C; Packaging: Tape and Reel; Package Quantity: 3000; Radiation Hardening: No; REACH SVHC: No SVHC; Lead Free: Lead Free; ComponentLink2URL: https://datasheet.ciiva.com/3213/bq29200-3213301.pdf?src-supplier=Avnet; ComponentLink2Description: https://datasheet.ciiva.com/3213/bq29200-3213301.pdf?src-supplier=Avnet; ComponentLink3URL: https://datasheet.ciiva.com/15115/getdatasheetpartid-517795-15115193.pdf?src-supplier=Verical; ComponentLink3Description: https://datasheet.ciiva.com/15115/getdatasheetpartid-517795-15115193.pdf?src-supplier=Verical; ComponentLink4URL: https://datasheet.ciiva.com/3214/bq29200-3214534.pdf?src-supplier=Avnet; ComponentLink4Description: https://datasheet.ciiva.com/3214/bq29200-3214534.pdf?src-supplier=Avnet; ComponentLink5URL: https://datasheet.ciiva.com/1932/bq29200-09-1932170.pdf?src-supplier=Digi-Key; ComponentLink5Description: https://datasheet.ciiva.com/1932/bq29200-09-1932170.pdf?src-supplier=Digi-Key; ComponentLink6URL: https://datasheet.ciiva.com/1932/bq29200-09-1932171.pdf?src-supplier=Digi-Key; ComponentLink6Description: https://datasheet.ciiva.com/1932/bq29200-09-1932171.pdf?src-supplier=Digi-Key; ComponentLink7URL: https://datasheet.ciiva.com/1932/bq29200-09-1932172.pdf?src-supplier=Digi-Key; ComponentLink7Description: https://datasheet.ciiva.com/1932/bq29200-09-1932172.pdf?src-supplier=Digi-Key
U4 = DS2438: Manufacturer: Maxim; Manufacturer Part Number: DS2438Z+T&R; Number of Batteries: 2; Min Supply Voltage: 2.4V; Max Supply Voltage: 10V; Interface: Serial; Supplier 1: Digi-Key; Stock 1: 6617; Pricing 1: 1=5.81000, 10=5.22100, 25=4.93640, 100=4.27810, 250=4.05872, 500=3.64188, 1000=3.07146 (USD); RoHS: Yes; Mount: Surface Mount; Case/Package: SOIC; Number of Pins: 8; Contact Plating: Tin; Min Operating Temperature: -40°C; Max Operating Temperature: 85°C; Packaging: Tape and Reel; Package Quantity: 2500; Radiation Hardening: No; REACH SVHC: No SVHC; Lead Free: Lead Free; ComponentLink1URL: https://datasheet.ciiva.com/12230/ds2438-21641-12230641.pdf?src-supplier=Mouser; ComponentLink1Description: https://datasheet.ciiva.com/12230/ds2438-21641-12230641.pdf?src-supplier=Mouser; ComponentLink2URL: https://datasheet.ciiva.com/3214/ds2438-3214698.pdf?src-supplier=Avnet; ComponentLink2Description: https://datasheet.ciiva.com/3214/ds2438-3214698.pdf?src-supplier=Avnet; ComponentLink3URL: https://datasheet.ciiva.com/14089/ds2438-14089309.pdf?src-supplier=Digi-Key; ComponentLink3Description: https://datasheet.ciiva.com/14089/ds2438-14089309.pdf?src-supplier=Digi-Key; ComponentLink4URL: https://datasheet.ciiva.com/17299/ds2438-17299519.pdf?src-supplier=Avnet+Europe; ComponentLink4Description: https://datasheet.ciiva.com/17299/ds2438-17299519.pdf?src-supplier=Avnet+Europe